# EAGLE design piezo-layer_v0.95-R001 (EAGLE 6.5.0)
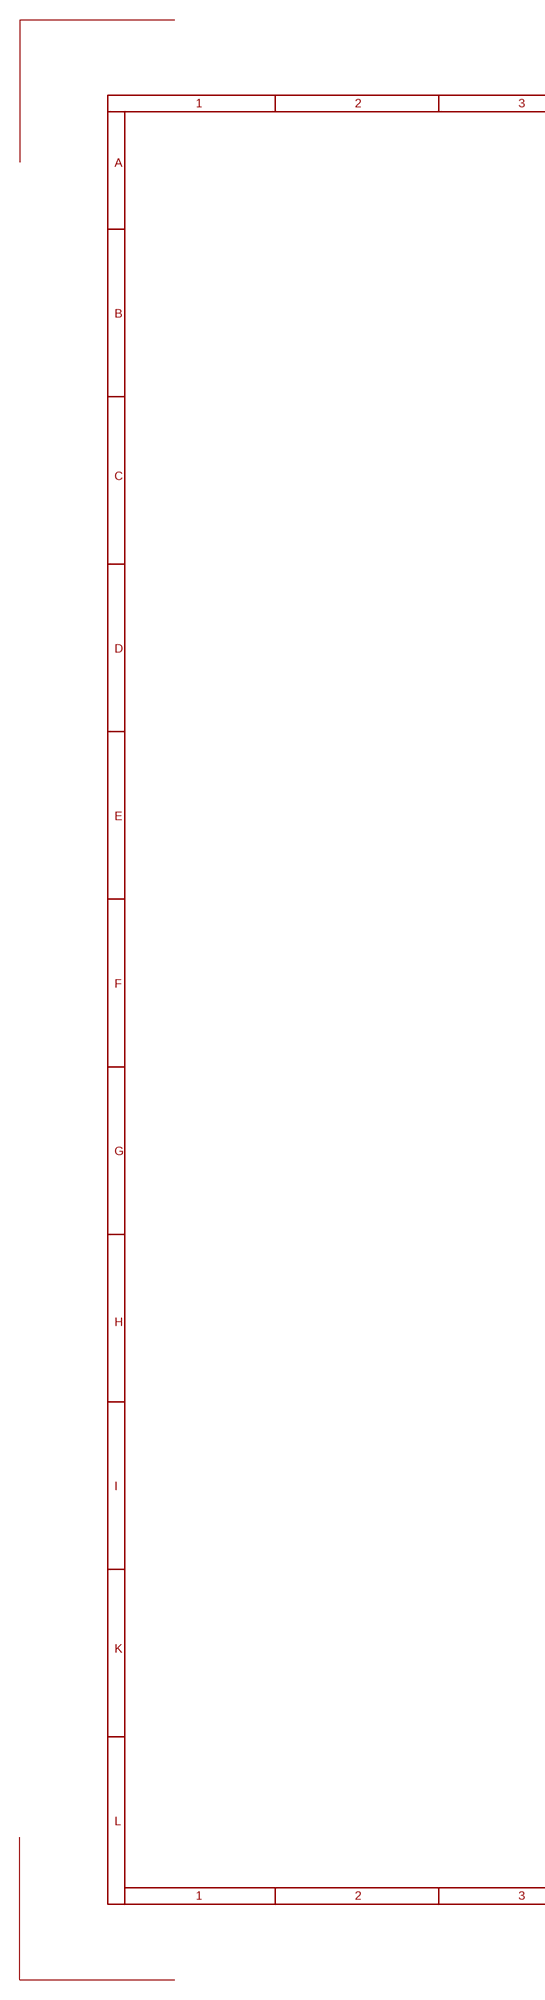
[diagram p0: schematic, sheet 1, part 1 of 2]
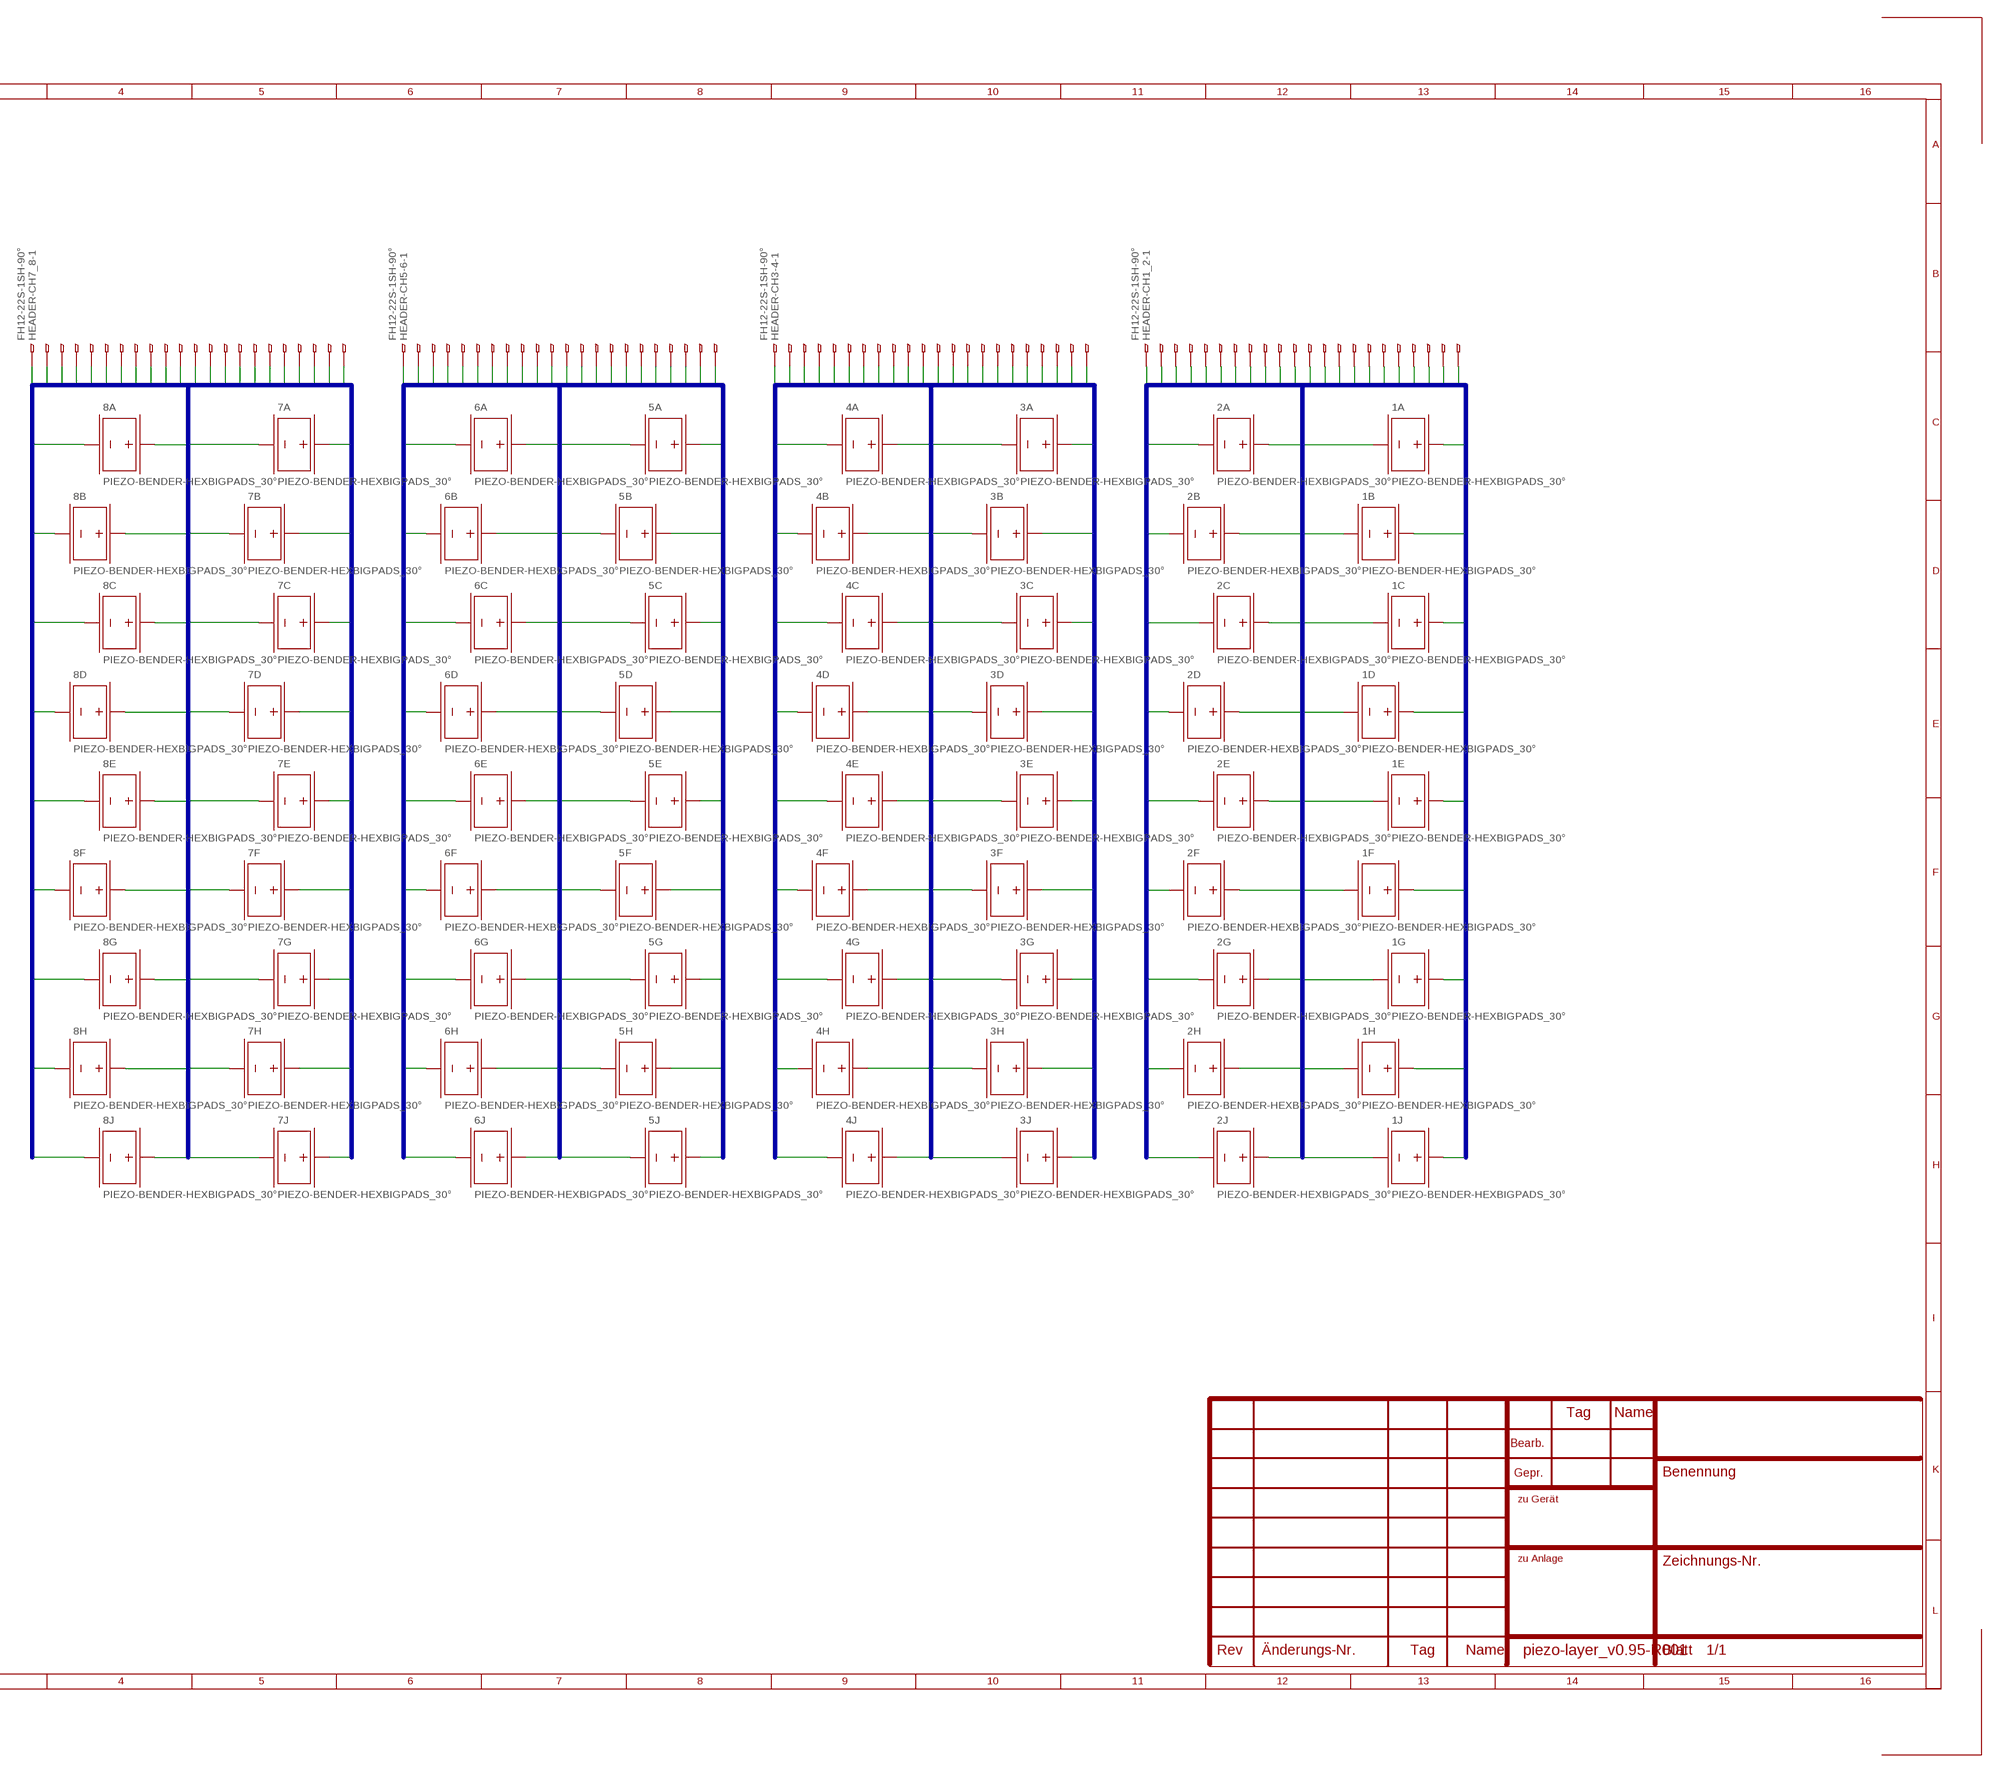
[diagram p1: schematic, sheet 1, part 2 of 2]

## Parts
1A  PIEZO-BENDER-HEXBIGPADS_30°  [PIEZO-BENDER-HEX_16MM_BIGPAD-30°]
1B  PIEZO-BENDER-HEXBIGPADS_30°  [PIEZO-BENDER-HEX_16MM_BIGPAD-30°]
1C  PIEZO-BENDER-HEXBIGPADS_30°  [PIEZO-BENDER-HEX_16MM_BIGPAD-30°]
1D  PIEZO-BENDER-HEXBIGPADS_30°  [PIEZO-BENDER-HEX_16MM_BIGPAD-30°]
1E  PIEZO-BENDER-HEXBIGPADS_30°  [PIEZO-BENDER-HEX_16MM_BIGPAD-30°]
1F  PIEZO-BENDER-HEXBIGPADS_30°  [PIEZO-BENDER-HEX_16MM_BIGPAD-30°]
1G  PIEZO-BENDER-HEXBIGPADS_30°  [PIEZO-BENDER-HEX_16MM_BIGPAD-30°]
1H  PIEZO-BENDER-HEXBIGPADS_30°  [PIEZO-BENDER-HEX_16MM_BIGPAD-30°]
1J  PIEZO-BENDER-HEXBIGPADS_30°  [PIEZO-BENDER-HEX_16MM_BIGPAD-30°]
2A  PIEZO-BENDER-HEXBIGPADS_30°  [PIEZO-BENDER-HEX_16MM_BIGPAD-30°]
2B  PIEZO-BENDER-HEXBIGPADS_30°  [PIEZO-BENDER-HEX_16MM_BIGPAD-30°]
2C  PIEZO-BENDER-HEXBIGPADS_30°  [PIEZO-BENDER-HEX_16MM_BIGPAD-30°]
2D  PIEZO-BENDER-HEXBIGPADS_30°  [PIEZO-BENDER-HEX_16MM_BIGPAD-30°]
2E  PIEZO-BENDER-HEXBIGPADS_30°  [PIEZO-BENDER-HEX_16MM_BIGPAD-30°]
2F  PIEZO-BENDER-HEXBIGPADS_30°  [PIEZO-BENDER-HEX_16MM_BIGPAD-30°]
2G  PIEZO-BENDER-HEXBIGPADS_30°  [PIEZO-BENDER-HEX_16MM_BIGPAD-30°]
2H  PIEZO-BENDER-HEXBIGPADS_30°  [PIEZO-BENDER-HEX_16MM_BIGPAD-30°]
2J  PIEZO-BENDER-HEXBIGPADS_30°  [PIEZO-BENDER-HEX_16MM_BIGPAD-30°]
3A  PIEZO-BENDER-HEXBIGPADS_30°  [PIEZO-BENDER-HEX_16MM_BIGPAD-30°]
3B  PIEZO-BENDER-HEXBIGPADS_30°  [PIEZO-BENDER-HEX_16MM_BIGPAD-30°]
3C  PIEZO-BENDER-HEXBIGPADS_30°  [PIEZO-BENDER-HEX_16MM_BIGPAD-30°]
3D  PIEZO-BENDER-HEXBIGPADS_30°  [PIEZO-BENDER-HEX_16MM_BIGPAD-30°]
3E  PIEZO-BENDER-HEXBIGPADS_30°  [PIEZO-BENDER-HEX_16MM_BIGPAD-30°]
3F  PIEZO-BENDER-HEXBIGPADS_30°  [PIEZO-BENDER-HEX_16MM_BIGPAD-30°]
3G  PIEZO-BENDER-HEXBIGPADS_30°  [PIEZO-BENDER-HEX_16MM_BIGPAD-30°]
3H  PIEZO-BENDER-HEXBIGPADS_30°  [PIEZO-BENDER-HEX_16MM_BIGPAD-30°]
3J  PIEZO-BENDER-HEXBIGPADS_30°  [PIEZO-BENDER-HEX_16MM_BIGPAD-30°]
4A  PIEZO-BENDER-HEXBIGPADS_30°  [PIEZO-BENDER-HEX_16MM_BIGPAD-30°]
4B  PIEZO-BENDER-HEXBIGPADS_30°  [PIEZO-BENDER-HEX_16MM_BIGPAD-30°]
4C  PIEZO-BENDER-HEXBIGPADS_30°  [PIEZO-BENDER-HEX_16MM_BIGPAD-30°]
4D  PIEZO-BENDER-HEXBIGPADS_30°  [PIEZO-BENDER-HEX_16MM_BIGPAD-30°]
4E  PIEZO-BENDER-HEXBIGPADS_30°  [PIEZO-BENDER-HEX_16MM_BIGPAD-30°]
4F  PIEZO-BENDER-HEXBIGPADS_30°  [PIEZO-BENDER-HEX_16MM_BIGPAD-30°]
4G  PIEZO-BENDER-HEXBIGPADS_30°  [PIEZO-BENDER-HEX_16MM_BIGPAD-30°]
4H  PIEZO-BENDER-HEXBIGPADS_30°  [PIEZO-BENDER-HEX_16MM_BIGPAD-30°]
4J  PIEZO-BENDER-HEXBIGPADS_30°  [PIEZO-BENDER-HEX_16MM_BIGPAD-30°]
5A  PIEZO-BENDER-HEXBIGPADS_30°  [PIEZO-BENDER-HEX_16MM_BIGPAD-30°]
5B  PIEZO-BENDER-HEXBIGPADS_30°  [PIEZO-BENDER-HEX_16MM_BIGPAD-30°]
5C  PIEZO-BENDER-HEXBIGPADS_30°  [PIEZO-BENDER-HEX_16MM_BIGPAD-30°]
5D  PIEZO-BENDER-HEXBIGPADS_30°  [PIEZO-BENDER-HEX_16MM_BIGPAD-30°]
5E  PIEZO-BENDER-HEXBIGPADS_30°  [PIEZO-BENDER-HEX_16MM_BIGPAD-30°]
5F  PIEZO-BENDER-HEXBIGPADS_30°  [PIEZO-BENDER-HEX_16MM_BIGPAD-30°]
5G  PIEZO-BENDER-HEXBIGPADS_30°  [PIEZO-BENDER-HEX_16MM_BIGPAD-30°]
5H  PIEZO-BENDER-HEXBIGPADS_30°  [PIEZO-BENDER-HEX_16MM_BIGPAD-30°]
5J  PIEZO-BENDER-HEXBIGPADS_30°  [PIEZO-BENDER-HEX_16MM_BIGPAD-30°]
6A  PIEZO-BENDER-HEXBIGPADS_30°  [PIEZO-BENDER-HEX_16MM_BIGPAD-30°]
6B  PIEZO-BENDER-HEXBIGPADS_30°  [PIEZO-BENDER-HEX_16MM_BIGPAD-30°]
6C  PIEZO-BENDER-HEXBIGPADS_30°  [PIEZO-BENDER-HEX_16MM_BIGPAD-30°]
6D  PIEZO-BENDER-HEXBIGPADS_30°  [PIEZO-BENDER-HEX_16MM_BIGPAD-30°]
6E  PIEZO-BENDER-HEXBIGPADS_30°  [PIEZO-BENDER-HEX_16MM_BIGPAD-30°]
6F  PIEZO-BENDER-HEXBIGPADS_30°  [PIEZO-BENDER-HEX_16MM_BIGPAD-30°]
6G  PIEZO-BENDER-HEXBIGPADS_30°  [PIEZO-BENDER-HEX_16MM_BIGPAD-30°]
6H  PIEZO-BENDER-HEXBIGPADS_30°  [PIEZO-BENDER-HEX_16MM_BIGPAD-30°]
6J  PIEZO-BENDER-HEXBIGPADS_30°  [PIEZO-BENDER-HEX_16MM_BIGPAD-30°]
7A  PIEZO-BENDER-HEXBIGPADS_30°  [PIEZO-BENDER-HEX_16MM_BIGPAD-30°]
7B  PIEZO-BENDER-HEXBIGPADS_30°  [PIEZO-BENDER-HEX_16MM_BIGPAD-30°]
7C  PIEZO-BENDER-HEXBIGPADS_30°  [PIEZO-BENDER-HEX_16MM_BIGPAD-30°]
7D  PIEZO-BENDER-HEXBIGPADS_30°  [PIEZO-BENDER-HEX_16MM_BIGPAD-30°]
7E  PIEZO-BENDER-HEXBIGPADS_30°  [PIEZO-BENDER-HEX_16MM_BIGPAD-30°]
7F  PIEZO-BENDER-HEXBIGPADS_30°  [PIEZO-BENDER-HEX_16MM_BIGPAD-30°]
7G  PIEZO-BENDER-HEXBIGPADS_30°  [PIEZO-BENDER-HEX_16MM_BIGPAD-30°]
7H  PIEZO-BENDER-HEXBIGPADS_30°  [PIEZO-BENDER-HEX_16MM_BIGPAD-30°]
7J  PIEZO-BENDER-HEXBIGPADS_30°  [PIEZO-BENDER-HEX_16MM_BIGPAD-30°]
8A  PIEZO-BENDER-HEXBIGPADS_30°  [PIEZO-BENDER-HEX_16MM_BIGPAD-30°]
8B  PIEZO-BENDER-HEXBIGPADS_30°  [PIEZO-BENDER-HEX_16MM_BIGPAD-30°]
8C  PIEZO-BENDER-HEXBIGPADS_30°  [PIEZO-BENDER-HEX_16MM_BIGPAD-30°]
8D  PIEZO-BENDER-HEXBIGPADS_30°  [PIEZO-BENDER-HEX_16MM_BIGPAD-30°]
8E  PIEZO-BENDER-HEXBIGPADS_30°  [PIEZO-BENDER-HEX_16MM_BIGPAD-30°]
8F  PIEZO-BENDER-HEXBIGPADS_30°  [PIEZO-BENDER-HEX_16MM_BIGPAD-30°]
8G  PIEZO-BENDER-HEXBIGPADS_30°  [PIEZO-BENDER-HEX_16MM_BIGPAD-30°]
8H  PIEZO-BENDER-HEXBIGPADS_30°  [PIEZO-BENDER-HEX_16MM_BIGPAD-30°]
8J  PIEZO-BENDER-HEXBIGPADS_30°  [PIEZO-BENDER-HEX_16MM_BIGPAD-30°]
HEADER-CH1_2  FH12-22S-1SH-90°  [FH12-22S-1SH]
HEADER-CH3-4  FH12-22S-1SH-90°  [FH12-22S-1SH]
HEADER-CH5-6  FH12-22S-1SH-90°  [FH12-22S-1SH]
HEADER-CH7_8  FH12-22S-1SH-90°  [FH12-22S-1SH]

## Nets
BUS1: 1A.TOP(+_1) HEADER-CH1_2.22
BUS2: 1B.TOP(+_1) HEADER-CH1_2.21
BUS3: 1C.TOP(+_1) HEADER-CH1_2.20
BUS4: 1D.TOP(+_1) HEADER-CH1_2.19
BUS5: 1A.BOTTOM(-_1) 1B.BOTTOM(-_1) 1C.BOTTOM(-_1) 1D.BOTTOM(-_1) 1E.BOTTOM(-_1) 1F.BOTTOM(-_1) 1G.BOTTOM(-_1) 1H.BOTTOM(-_1) 1J.BOTTOM(-_1) HEADER-CH1_2.12 HEADER-CH1_2.18
BUS6: 1E.TOP(+_1) HEADER-CH1_2.17
BUS7: 1F.TOP(+_1) HEADER-CH1_2.16
BUS8: 1G.TOP(+_1) HEADER-CH1_2.15
BUS9: 1H.TOP(+_1) HEADER-CH1_2.14
BUS10: 1J.TOP(+_1) HEADER-CH1_2.13
BUS11: 2A.TOP(+_1) HEADER-CH1_2.11
BUS12: 2B.TOP(+_1) HEADER-CH1_2.10
BUS13: 2C.TOP(+_1) HEADER-CH1_2.9
BUS14: 2D.TOP(+_1) HEADER-CH1_2.8
BUS15: 2A.BOTTOM(-_1) 2B.BOTTOM(-_1) 2C.BOTTOM(-_1) 2D.BOTTOM(-_1) 2E.BOTTOM(-_1) 2F.BOTTOM(-_1) 2G.BOTTOM(-_1) 2H.BOTTOM(-_1) 2J.BOTTOM(-_1) HEADER-CH1_2.1 HEADER-CH1_2.7
BUS16: 2E.TOP(+_1) HEADER-CH1_2.6
BUS17: 2F.TOP(+_1) HEADER-CH1_2.5
BUS18: 2G.TOP(+_1) HEADER-CH1_2.4
BUS19: 2H.TOP(+_1) HEADER-CH1_2.3
BUS20: 2J.TOP(+_1) HEADER-CH1_2.2
BUS21: 3A.TOP(+_1) HEADER-CH3-4.22
BUS22: 3B.TOP(+_1) HEADER-CH3-4.21
BUS23: 3C.TOP(+_1) HEADER-CH3-4.20
BUS24: 3D.TOP(+_1) HEADER-CH3-4.19
BUS25: 3A.BOTTOM(-_1) 3B.BOTTOM(-_1) 3C.BOTTOM(-_1) 3D.BOTTOM(-_1) 3E.BOTTOM(-_1) 3F.BOTTOM(-_1) 3G.BOTTOM(-_1) 3H.BOTTOM(-_1) 3J.BOTTOM(-_1) HEADER-CH3-4.12 HEADER-CH3-4.18
BUS26: 3E.TOP(+_1) HEADER-CH3-4.17
BUS27: 3F.TOP(+_1) HEADER-CH3-4.16
BUS28: 3G.TOP(+_1) HEADER-CH3-4.15
BUS29: 3H.TOP(+_1) HEADER-CH3-4.14
BUS30: 3J.TOP(+_1) HEADER-CH3-4.13
BUS31: 4A.TOP(+_1) HEADER-CH3-4.11
BUS32: 4B.TOP(+_1) HEADER-CH3-4.10
BUS33: 4C.TOP(+_1) HEADER-CH3-4.9
BUS34: 4D.TOP(+_1) HEADER-CH3-4.8
BUS35: 4A.BOTTOM(-_1) 4B.BOTTOM(-_1) 4C.BOTTOM(-_1) 4D.BOTTOM(-_1) 4E.BOTTOM(-_1) 4F.BOTTOM(-_1) 4G.BOTTOM(-_1) 4H.BOTTOM(-_1) 4J.BOTTOM(-_1) HEADER-CH3-4.1 HEADER-CH3-4.7
BUS36: 4E.TOP(+_1) HEADER-CH3-4.6
BUS37: 4F.TOP(+_1) HEADER-CH3-4.5
BUS38: 4G.TOP(+_1) HEADER-CH3-4.4
BUS39: 4H.TOP(+_1) HEADER-CH3-4.3
BUS40: 4J.TOP(+_1) HEADER-CH3-4.2
BUS41: 5A.TOP(+_1) HEADER-CH5-6.22
BUS42: 5B.TOP(+_1) HEADER-CH5-6.21
BUS43: 5C.TOP(+_1) HEADER-CH5-6.20
BUS44: 5D.TOP(+_1) HEADER-CH5-6.19
BUS45: 5A.BOTTOM(-_1) 5B.BOTTOM(-_1) 5C.BOTTOM(-_1) 5D.BOTTOM(-_1) 5E.BOTTOM(-_1) 5F.BOTTOM(-_1) 5G.BOTTOM(-_1) 5H.BOTTOM(-_1) 5J.BOTTOM(-_1) HEADER-CH5-6.12 HEADER-CH5-6.18
BUS46: 5E.TOP(+_1) HEADER-CH5-6.17
BUS47: 5F.TOP(+_1) HEADER-CH5-6.16
BUS48: 5G.TOP(+_1) HEADER-CH5-6.15
BUS49: 5H.TOP(+_1) HEADER-CH5-6.14
BUS50: 5J.TOP(+_1) HEADER-CH5-6.13
BUS51: 6A.TOP(+_1) HEADER-CH5-6.11
BUS52: 6B.TOP(+_1) HEADER-CH5-6.10
BUS53: 6C.TOP(+_1) HEADER-CH5-6.9
BUS54: 6D.TOP(+_1) HEADER-CH5-6.8
BUS55: 6A.BOTTOM(-_1) 6B.BOTTOM(-_1) 6C.BOTTOM(-_1) 6D.BOTTOM(-_1) 6E.BOTTOM(-_1) 6F.BOTTOM(-_1) 6G.BOTTOM(-_1) 6H.BOTTOM(-_1) 6J.BOTTOM(-_1) HEADER-CH5-6.1 HEADER-CH5-6.7
BUS56: 6E.TOP(+_1) HEADER-CH5-6.6
BUS57: 6F.TOP(+_1) HEADER-CH5-6.5
BUS58: 6G.TOP(+_1) HEADER-CH5-6.4
BUS59: 6H.TOP(+_1) HEADER-CH5-6.3
BUS60: 6J.TOP(+_1) HEADER-CH5-6.2
BUS61: 7A.TOP(+_1) HEADER-CH7_8.22
BUS62: 7B.TOP(+_1) HEADER-CH7_8.21
BUS63: 7C.TOP(+_1) HEADER-CH7_8.20
BUS64: 7D.TOP(+_1) HEADER-CH7_8.19
BUS65: 7A.BOTTOM(-_1) 7B.BOTTOM(-_1) 7C.BOTTOM(-_1) 7D.BOTTOM(-_1) 7E.BOTTOM(-_1) 7F.BOTTOM(-_1) 7G.BOTTOM(-_1) 7H.BOTTOM(-_1) 7J.BOTTOM(-_1) HEADER-CH7_8.12 HEADER-CH7_8.18
BUS66: 7E.TOP(+_1) HEADER-CH7_8.17
BUS67: 7F.TOP(+_1) HEADER-CH7_8.16
BUS68: 7G.TOP(+_1) HEADER-CH7_8.15
BUS69: 7H.TOP(+_1) HEADER-CH7_8.14
BUS70: 7J.TOP(+_1) HEADER-CH7_8.13
BUS71: 8A.TOP(+_1) HEADER-CH7_8.11
BUS72: 8B.TOP(+_1) HEADER-CH7_8.10
BUS73: 8C.TOP(+_1) HEADER-CH7_8.9
BUS74: 8D.TOP(+_1) HEADER-CH7_8.8
BUS75: 8A.BOTTOM(-_1) 8B.BOTTOM(-_1) 8C.BOTTOM(-_1) 8D.BOTTOM(-_1) 8E.BOTTOM(-_1) 8F.BOTTOM(-_1) 8G.BOTTOM(-_1) 8H.BOTTOM(-_1) 8J.BOTTOM(-_1) HEADER-CH7_8.1 HEADER-CH7_8.7
BUS76: 8E.TOP(+_1) HEADER-CH7_8.6
BUS77: 8F.TOP(+_1) HEADER-CH7_8.5
BUS78: 8G.TOP(+_1) HEADER-CH7_8.4
BUS79: 8H.TOP(+_1) HEADER-CH7_8.3
BUS80: 8J.TOP(+_1) HEADER-CH7_8.2

## Buses
BUS[1..20]
BUS[21..40]
BUS[41..60]
BUS[61..80]

## Library data of the parts
1A 1B 1C 1D 1E 1F 1G 1H 1J 2A 2B 2C 2D 2E 2F 2G 2H 2J 3A 3B 3C 3D 3E 3F 3G 3H 3J 4A 4B 4C 4D 4E 4F 4G 4H 4J 5A 5B 5C 5D 5E 5F 5G 5H 5J 6A 6B 6C 6D 6E 6F 6G 6H 6J 7A 7B 7C 7D 7E 7F 7G 7H 7J 8A 8B 8C 8D 8E 8F 8G 8H 8J = ICST:PIEZO-BENDER-HEX
HEADER-CH1_2 HEADER-CH3-4 HEADER-CH5-6 HEADER-CH7_8 = ICST:FH12-22S-1SH

## Board
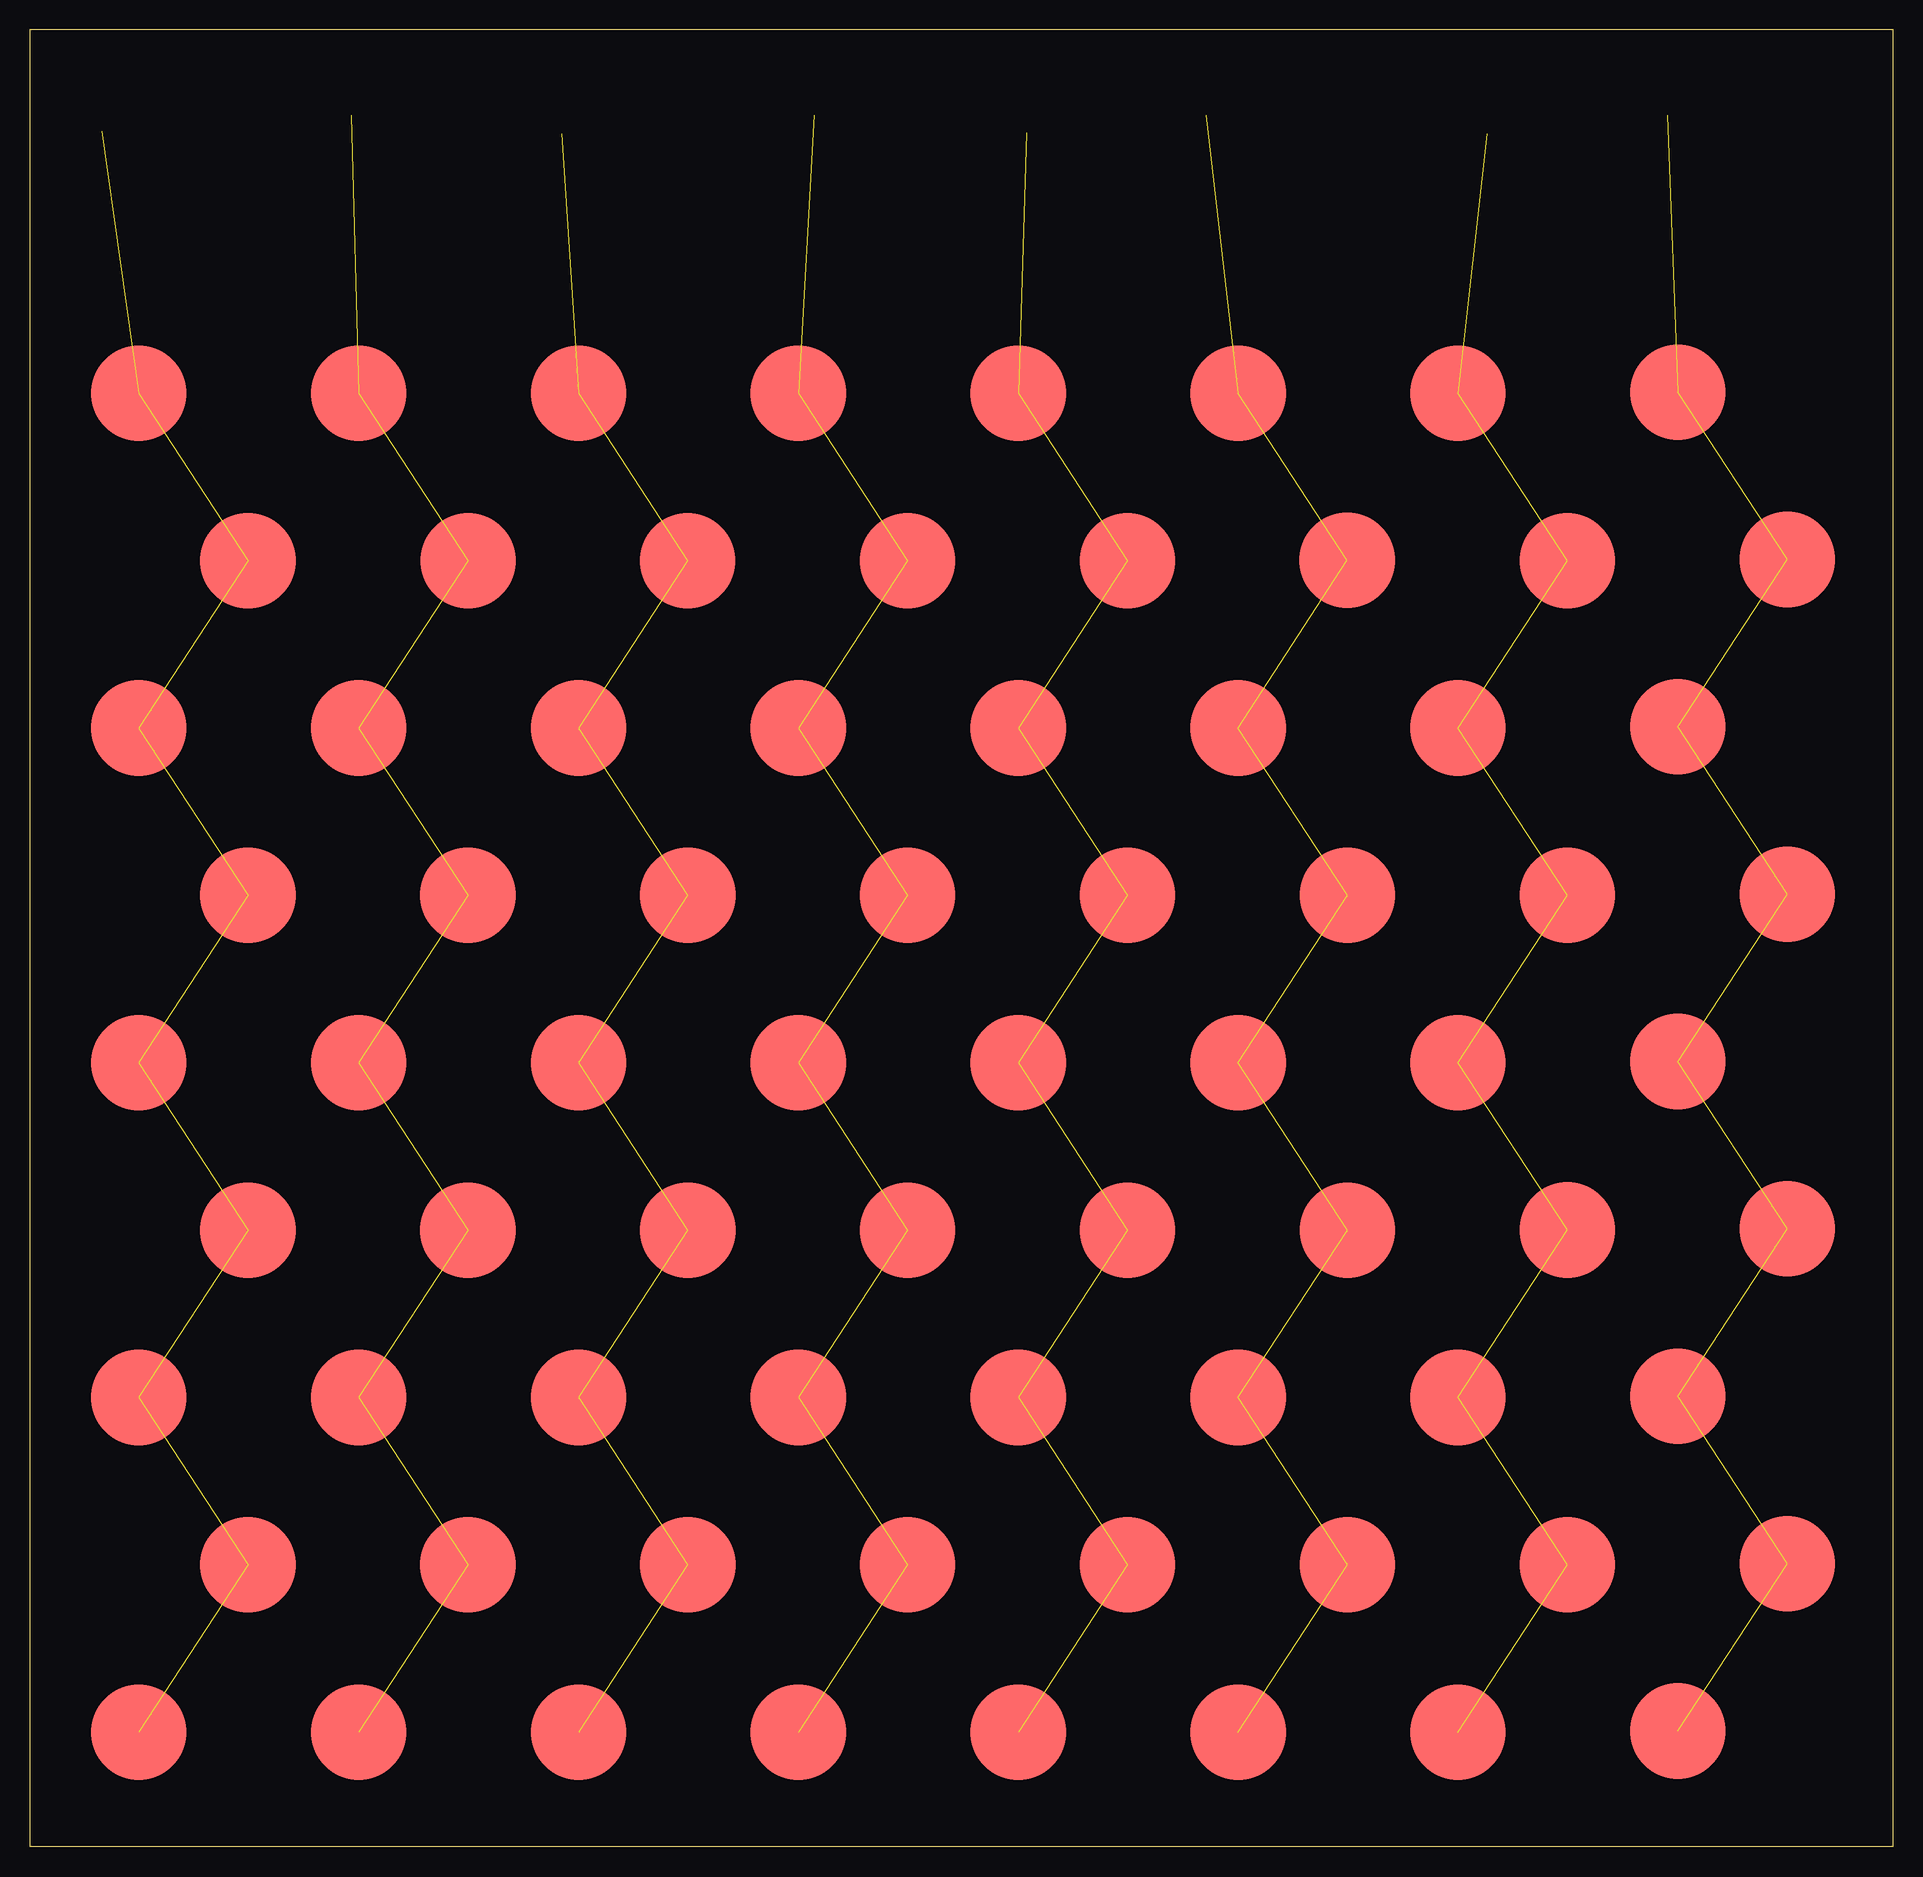
[diagram p2: board, top side]
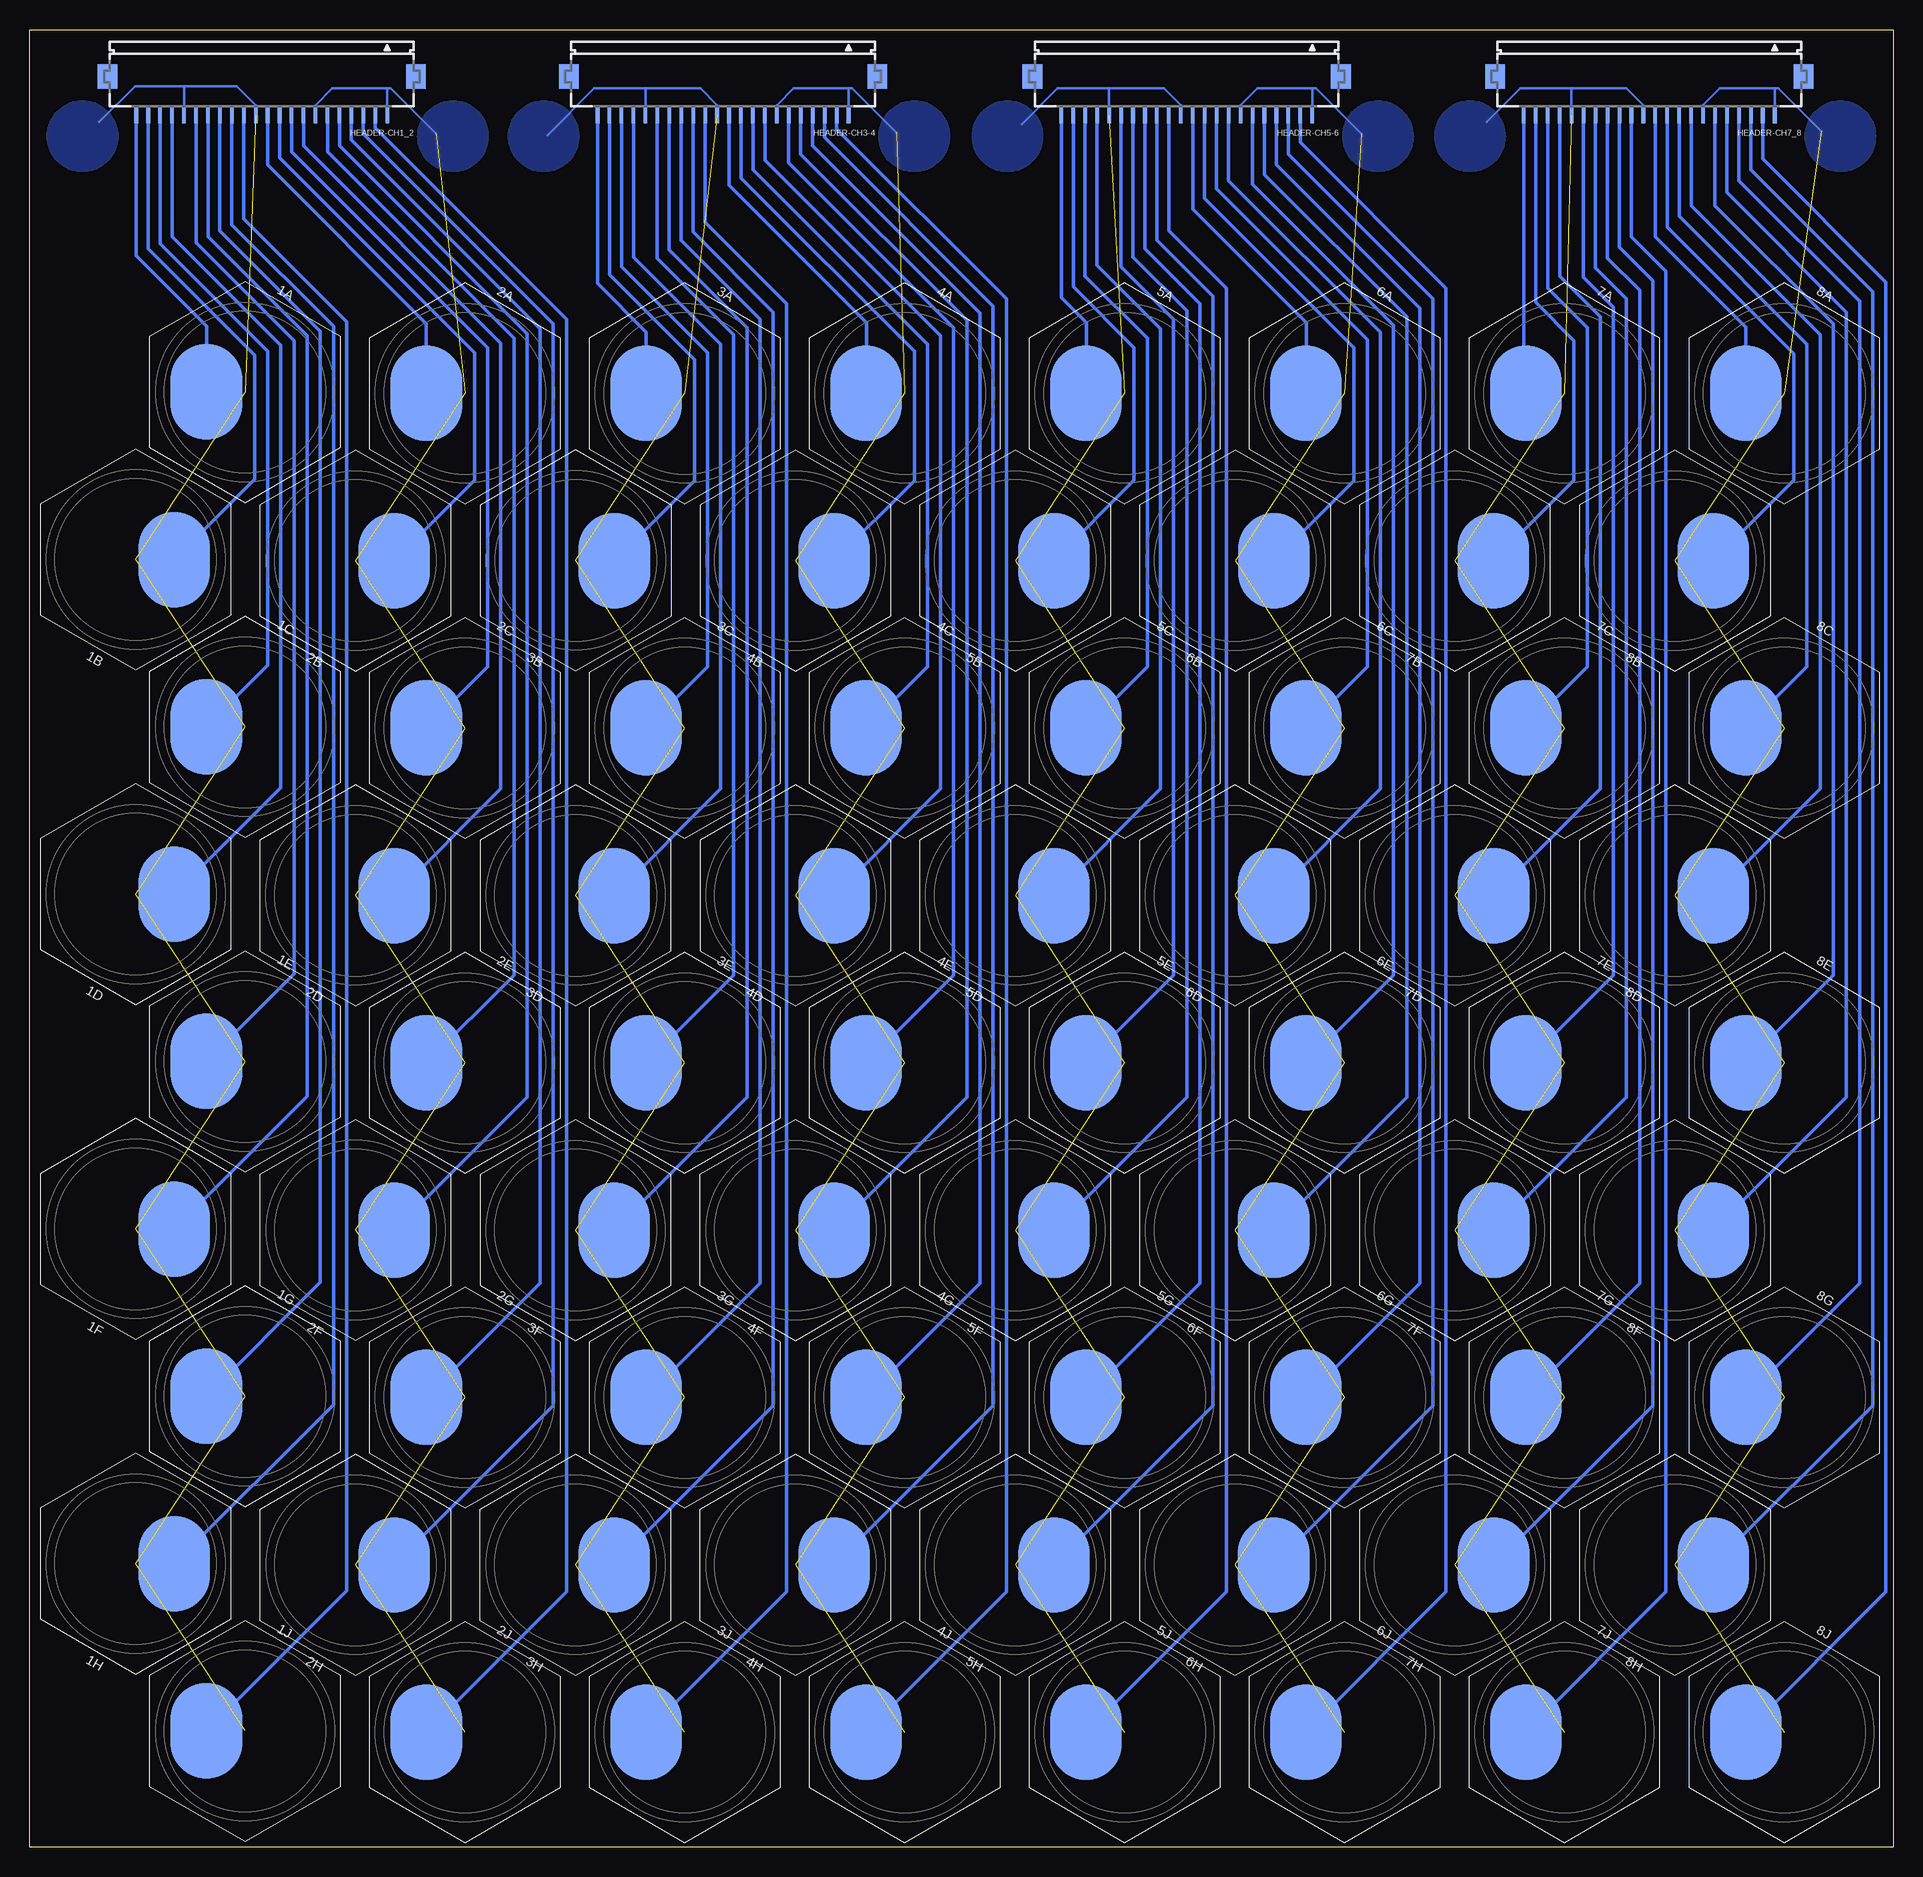
[diagram p3: board, bottom side, seen from below]

Size 155.9 x 152 mm. Coordinates in mm from the lower left corner, seen from the top.
Outline: 155.9,152 0,152 0,0 155.9,0 155.9,152
Copper layers 1*16: Top 0.012mm / dielectric 0.025mm / Bottom 0.012mm
Design rules "1L-0.025-0.15_0.3mm *": minimum track width 0.2mm, minimum drill 0.3mm, track to track 0.15mm, track to pad 0.15mm, pad to pad 0.15mm, via to via 0.15mm, smd to smd 0.15mm, copper to edge 0.5mm, drill to drill 1mm, minimum pad ring 10mil, minimum via ring 8mil, stop-mask expansion 4mil, vias tented up to drill 0mil, thermal gap 10mil

### Footprints (pad centres in the part's own frame; a part is rotated, then mirrored left to right if it is on the bottom)
PIEZO-BENDER-HEX_16MM_BIGPAD-30° = smd 8 x 8 bottom: BOTTOM 0,0 | smd 6 x 8 rotated 210: TOP -2.8,-1.6
FH12-22S-1SH = smd 0.3 x 1.3: 1 -10.5,3.25; 2 -9.5,3.25; 3 -8.5,3.25; 4 -7.5,3.25; 5 -6.5,3.25; 6 -5.5,3.25; 7 -4.5,3.25; 8 -3.5,3.25; 9 -2.5,3.25; 10 -1.5,3.25; 11 -0.5,3.25; 12 0.5,3.25; 13 1.5,3.25; 14 2.5,3.25; 15 3.5,3.25; 16 4.5,3.25; 17 5.5,3.25; 18 6.5,3.25; 19 7.5,3.25; 20 8.5,3.25; 21 9.5,3.25; 22 10.5,3.25 | smd 1.65 x 2.05: PAD1 -12.9,0; PAD2 12.9,0

### Placement (x,y rotation side)
1A  137.9,121.7 330 bottom
1B  147.05,107.7 150 bottom
1C  137.9,93.7 330 bottom
1D  147.05,79.7 150 bottom
1E  137.9,65.7 330 bottom
1F  147.05,51.7 150 bottom
1G  137.9,37.7 330 bottom
1H  147.05,23.7 150 bottom
1J  137.9,9.7 330 bottom
2A  119.5,121.6 330 bottom
2B  128.65,107.6 150 bottom
2C  119.5,93.6 330 bottom
2D  128.66,79.6 150 bottom
2E  119.5,65.6 330 bottom
2F  128.65,51.61 150 bottom
2G  119.5,37.6 330 bottom
2H  128.65,23.6 150 bottom
2J  119.5,9.6 330 bottom
3A  101.1,121.6 330 bottom
3B  110.22,107.62 150 bottom
3C  101.1,93.6 330 bottom
3D  110.24,79.6 150 bottom
3E  101.1,65.6 330 bottom
3F  110.24,51.6 150 bottom
3G  101.1,37.6 330 bottom
3H  110.25,23.6 150 bottom
3J  101.1,9.6 330 bottom
4A  82.7,121.6 330 bottom
4B  91.84,107.6 150 bottom
4C  82.7,93.6 330 bottom
4D  91.84,79.6 150 bottom
4E  82.7,65.6 330 bottom
4F  91.85,51.6 150 bottom
4G  82.7,37.6 330 bottom
4H  91.85,23.6 150 bottom
4J  82.7,9.6 330 bottom
5A  64.3,121.6 330 bottom
5B  73.45,107.6 150 bottom
5C  64.3,93.6 330 bottom
5D  73.45,79.6 150 bottom
5E  64.3,65.6 330 bottom
5F  73.45,51.6 150 bottom
5G  64.3,37.6 330 bottom
5H  73.45,23.6 150 bottom
5J  64.3,9.6 330 bottom
6A  45.9,121.6 330 bottom
6B  55.04,107.6 150 bottom
6C  45.9,93.6 330 bottom
6D  55.05,79.6 150 bottom
6E  45.9,65.6 330 bottom
6F  55.05,51.6 150 bottom
6G  45.9,37.6 330 bottom
6H  55.05,23.6 150 bottom
6J  45.9,9.6 330 bottom
7A  27.5,121.6 330 bottom
7B  36.66,107.6 150 bottom
7C  27.5,93.6 330 bottom
7D  36.65,79.6 150 bottom
7E  27.5,65.6 330 bottom
7F  36.65,51.6 150 bottom
7G  27.5,37.6 330 bottom
7H  36.65,23.6 150 bottom
7J  27.5,9.6 330 bottom
8A  9.1,121.6 330 bottom
8B  18.25,107.6 150 bottom
8C  9.1,93.6 330 bottom
8D  18.25,79.6 150 bottom
8E  9.1,65.6 330 bottom
8F  18.25,51.6 150 bottom
8G  9.1,37.6 330 bottom
8H  18.25,23.6 150 bottom
8J  9.1,9.6 330 bottom
HEADER-CH1_2  136.5,148.1 180 bottom
HEADER-CH3-4  97.9,148.1 180 bottom
HEADER-CH5-6  59.1,148.1 180 bottom
HEADER-CH7_8  20.4,148.1 180 bottom

### Tracks (layer width: path | path; a pad name or v marks a point on that pad's centre or on a via)
BUS1
  Bottom 0.3: HEADER-CH1_2.22 147,133.1 141.12,127.22 1A.TOP
BUS2
  Bottom 0.3: HEADER-CH1_2.21 146,133.7 137.1,124.8 137.1,114.41 1B.TOP
BUS3
  Bottom 0.3: HEADER-CH1_2.20 145,134.1 136,125.1 136,98.84 1C.TOP
BUS4
  Bottom 0.3: HEADER-CH1_2.19 144,134.7 134.9,125.6 134.9,88.61 1D.TOP
BUS5  (9 unrouted)
  Bottom 0.2: HEADER-CH1_2.12 137,145.7 138.6,147.3 143,147.3 | 143,147.3 147.1,147.3 150.1,144.3 | HEADER-CH1_2.18 143,147.3
  pour Bottom: 148.6,143.1 arc90 151.5,140.2 arc90 154.4,143.1 arc90 151.5,146 arc90
BUS6
  Bottom 0.3: HEADER-CH1_2.17 142,134.2 133.8,126 133.8,73.04 1E.TOP
BUS7
  Bottom 0.3: HEADER-CH1_2.16 141,134.7 132.7,126.4 132.7,62.81 1F.TOP
BUS8
  Bottom 0.3: HEADER-CH1_2.15 140,135.2 131.6,126.8 131.6,47.24 1G.TOP
BUS9
  Bottom 0.3: HEADER-CH1_2.14 139,135.7 130.5,127.2 130.5,37.01 1H.TOP
BUS10
  Bottom 0.3: HEADER-CH1_2.13 138,136.2 129.4,127.6 129.4,21.44 1J.TOP
BUS11
  Bottom 0.3: HEADER-CH1_2.11 136,140.7 122.72,127.42 2A.TOP
BUS12
  Bottom 0.3: HEADER-CH1_2.10 135,141.3 118.7,125 118.7,114.31 2B.TOP
BUS13
  Bottom 0.3: HEADER-CH1_2.9 134,141.8 117.6,125.4 117.6,98.74 2C.TOP
BUS14
  Bottom 0.3: HEADER-CH1_2.8 133,142.3 116.5,125.8 116.5,88.52 2D.TOP
BUS15  (9 unrouted)
  Bottom 0.2: HEADER-CH1_2.7 132,145.7 130.6,147.1 126,147.1 | 126,147.1 125.7,147.1 121.9,143.3 | HEADER-CH1_2.1 126,147.1
  pour Bottom: 123.4,143.1 arc90 120.5,146 arc90 117.6,143.1 arc90 120.5,140.2 arc90
BUS16
  Bottom 0.3: HEADER-CH1_2.6 131,141.8 115.4,126.2 115.4,72.94 2E.TOP
BUS17
  Bottom 0.3: HEADER-CH1_2.5 130,142.3 114.3,126.6 114.3,62.72 2F.TOP
BUS18
  Bottom 0.3: HEADER-CH1_2.4 129,142.8 113.2,127 113.2,47.14 2G.TOP
BUS19
  Bottom 0.3: HEADER-CH1_2.3 128,143.3 112.1,127.4 112.1,36.91 2H.TOP
BUS20
  Bottom 0.3: HEADER-CH1_2.2 127,143.8 111,127.8 111,21.34 2J.TOP
BUS21
  Bottom 0.3: HEADER-CH3-4.22 108.4,130.8 104.33,126.72 3A.TOP
BUS22
  Bottom 0.3: HEADER-CH3-4.21 107.4,131.5 100.3,124.4 100.3,114.3 3B.TOP
BUS23
  Bottom 0.3: HEADER-CH3-4.20 106.4,132.2 99.2,125 99.2,98.74 3C.TOP
BUS24
  Bottom 0.3: HEADER-CH3-4.19 105.4,133 98.1,125.7 98.1,88.5 3D.TOP
BUS25  (9 unrouted)
  Bottom 0.2: HEADER-CH3-4.12 98.4,145.7 99.8,147.1 104.4,147.1 | 104.4,147.1 108.7,147.1 112.6,143.2 | HEADER-CH3-4.18 104.4,147.1
  pour Bottom: 110,143.1 arc90 112.9,140.2 arc90 115.8,143.1 arc90 112.9,146 arc90
BUS26
  Bottom 0.3: HEADER-CH3-4.17 103.4,132.9 97,126.5 97,72.94 3E.TOP
BUS27
  Bottom 0.3: HEADER-CH3-4.16 102.4,133.6 95.9,127.1 95.9,62.7 3F.TOP
BUS28
  Bottom 0.3: HEADER-CH3-4.15 101.4,134.4 94.8,127.8 94.8,47.14 3G.TOP
BUS29
  Bottom 0.3: HEADER-CH3-4.14 100.4,135.1 93.7,128.4 93.7,36.91 3H.TOP
BUS30
  Bottom 0.3: HEADER-CH3-4.13 99.4,135.9 92.6,129.1 92.6,21.34 3J.TOP
BUS31
  Bottom 0.3: HEADER-CH3-4.11 97.4,139 85.9,127.5 85.9,121.64 4A.TOP
BUS32
  Bottom 0.3: HEADER-CH3-4.10 96.4,139.6 81.9,125.1 81.9,114.3 4B.TOP
BUS33
  Bottom 0.3: HEADER-CH3-4.9 95.4,140.3 80.8,125.7 80.8,98.74 4C.TOP
BUS34
  Bottom 0.3: HEADER-CH3-4.8 94.4,141.1 79.7,126.4 79.7,88.5 4D.TOP
BUS35  (9 unrouted)
  Bottom 0.2: HEADER-CH3-4.7 93.4,145.7 92,147.1 87.4,147.1 | 87.4,147.1 87.1,147.1 83.4,143.4 | HEADER-CH3-4.1 87.4,147.1
  pour Bottom: 84.8,143.1 arc90 81.9,146 arc90 79,143.1 arc90 81.9,140.2 arc90
BUS36
  Bottom 0.3: HEADER-CH3-4.6 92.4,140.9 78.6,127.1 78.6,72.94 4E.TOP
BUS37
  Bottom 0.3: HEADER-CH3-4.5 91.4,141.6 77.5,127.7 77.5,62.71 4F.TOP
BUS38
  Bottom 0.3: HEADER-CH3-4.4 90.4,142.3 76.4,128.3 76.4,47.14 4G.TOP
BUS39
  Bottom 0.3: HEADER-CH3-4.3 89.4,143 75.3,128.9 75.3,36.91 4H.TOP
BUS40
  Bottom 0.3: HEADER-CH3-4.2 88.4,143.7 74.2,129.5 74.2,21.34 4J.TOP
BUS41
  Bottom 0.3: HEADER-CH5-6.22 69.6,129.6 67.5,127.5 67.5,121.64 5A.TOP
BUS42
  Bottom 0.3: HEADER-CH5-6.21 68.6,130.5 63.5,125.4 63.5,114.31 5B.TOP
BUS43
  Bottom 0.3: HEADER-CH5-6.20 67.6,131.4 62.4,126.2 62.4,98.74 5C.TOP
BUS44
  Bottom 0.3: HEADER-CH5-6.19 66.6,132.3 61.3,127 61.3,88.51 5D.TOP
BUS45  (9 unrouted)
  Bottom 0.2: HEADER-CH5-6.12 59.6,145.7 61,147.1 65.6,147.1 | 65.6,147.1 69.9,147.1 72.9,144.1 | HEADER-CH5-6.18 65.6,147.1
  pour Bottom: 71.2,143.1 arc90 74.1,140.2 arc90 77,143.1 arc90 74.1,146 arc90
BUS46
  Bottom 0.3: HEADER-CH5-6.17 64.6,132.2 60.2,127.8 60.2,72.94 5E.TOP
BUS47
  Bottom 0.3: HEADER-CH5-6.16 63.6,133 59.1,128.5 59.1,62.71 5F.TOP
BUS48
  Bottom 0.3: HEADER-CH5-6.15 62.6,133.7 58,129.1 58,47.14 5G.TOP
BUS49
  Bottom 0.3: HEADER-CH5-6.14 61.6,134.4 56.9,129.7 56.9,36.91 5H.TOP
BUS50
  Bottom 0.3: HEADER-CH5-6.13 60.6,135.2 55.8,130.4 55.8,21.34 5J.TOP
BUS51
  Bottom 0.3: HEADER-CH5-6.11 58.6,137 49.1,127.5 49.1,121.64 6A.TOP
BUS52
  Bottom 0.3: HEADER-CH5-6.10 57.6,137.9 45.1,125.4 45.1,114.3 6B.TOP
BUS53
  Bottom 0.3: HEADER-CH5-6.9 56.6,138.7 44,126.1 44,98.74 6C.TOP
BUS54
  Bottom 0.3: HEADER-CH5-6.8 55.6,139.4 42.9,126.7 42.9,88.51 6D.TOP
BUS55  (9 unrouted)
  Bottom 0.2: HEADER-CH5-6.7 54.6,145.7 53.2,147.1 48.6,147.1 | 44.5,143.3 48.3,147.1 48.6,147.1 | HEADER-CH5-6.1 48.6,147.1
  pour Bottom: 46,143.1 arc90 43.1,146 arc90 40.2,143.1 arc90 43.1,140.2 arc90
BUS56
  Bottom 0.3: HEADER-CH5-6.6 53.6,139.1 41.8,127.3 41.8,72.94 6E.TOP
BUS57
  Bottom 0.3: HEADER-CH5-6.5 52.6,139.9 40.7,128 40.7,62.71 6F.TOP
BUS58
  Bottom 0.3: HEADER-CH5-6.4 51.6,140.7 39.6,128.7 39.6,47.14 6G.TOP
BUS59
  Bottom 0.3: HEADER-CH5-6.3 50.6,141.6 38.5,129.5 38.5,36.91 6H.TOP
BUS60
  Bottom 0.3: HEADER-CH5-6.2 49.6,142.6 37.4,130.4 37.4,21.34 6J.TOP
BUS61
  Bottom 0.3: HEADER-CH7_8.22 30.9,121.79 7A.TOP
BUS62
  Bottom 0.3: HEADER-CH7_8.21 29.9,129.2 26.7,126 26.7,114.32 7B.TOP
BUS63
  Bottom 0.3: HEADER-CH7_8.20 28.9,130.4 25.6,127.1 25.6,98.74 7C.TOP
BUS64
  Bottom 0.3: HEADER-CH7_8.19 27.9,131.4 24.5,128 24.5,88.51 7D.TOP
BUS65  (9 unrouted)
  Bottom 0.2: HEADER-CH7_8.12 20.9,145.7 22.3,147.1 26.9,147.1 | 26.9,147.1 31.2,147.1 34,144.3 | HEADER-CH7_8.18 26.9,147.1
  pour Bottom: 32.5,143.1 arc90 35.4,140.2 arc90 38.3,143.1 arc90 35.4,146 arc90
BUS66
  Bottom 0.3: HEADER-CH7_8.17 25.9,131.3 23.4,128.8 23.4,72.94 7E.TOP
BUS67
  Bottom 0.3: HEADER-CH7_8.16 24.9,132.1 22.3,129.5 22.3,62.71 7F.TOP
BUS68
  Bottom 0.3: HEADER-CH7_8.15 23.9,132.9 21.2,130.2 21.2,47.14 7G.TOP
BUS69
  Bottom 0.3: HEADER-CH7_8.14 22.9,133.8 20.1,131 20.1,36.91 7H.TOP
BUS70
  Bottom 0.3: HEADER-CH7_8.13 21.9,134.7 19,131.8 19,21.34 7J.TOP
BUS71
  Bottom 0.3: HEADER-CH7_8.11 19.9,134.7 12.32,127.12 8A.TOP
BUS72
  Bottom 0.3: HEADER-CH7_8.10 18.9,135.5 8.3,124.9 8.3,114.31 8B.TOP
BUS73
  Bottom 0.3: HEADER-CH7_8.9 17.9,136.4 7.2,125.7 7.2,98.74 8C.TOP
BUS74
  Bottom 0.3: HEADER-CH7_8.8 16.9,137.3 6.1,126.5 6.1,88.51 8D.TOP
BUS75  (9 unrouted)
  Bottom 0.2: HEADER-CH7_8.7 15.9,145.7 14.5,147.1 9.9,147.1 | 9.9,147.1 9.6,147.1 6,143.5 | HEADER-CH7_8.1 9.9,147.1
  pour Bottom: 7.3,143.1 arc90 4.4,146 arc90 1.5,143.1 arc90 4.4,140.2 arc90
BUS76
  Bottom 0.3: HEADER-CH7_8.6 14.9,137.3 5,127.4 5,72.94 8E.TOP
BUS77
  Bottom 0.3: HEADER-CH7_8.5 13.9,138.4 3.9,128.4 3.9,62.71 8F.TOP
BUS78
  Bottom 0.3: HEADER-CH7_8.4 12.9,139.4 2.8,129.3 2.8,47.14 8G.TOP
BUS79
  Bottom 0.3: HEADER-CH7_8.3 11.9,140.3 1.7,130.1 1.7,36.91 8H.TOP
BUS80
  Bottom 0.3: HEADER-CH7_8.2 10.9,141.2 0.6,130.9 0.6,21.34 8J.TOP